# EAGLE design bat_mini2 (EAGLE 9.0.0)
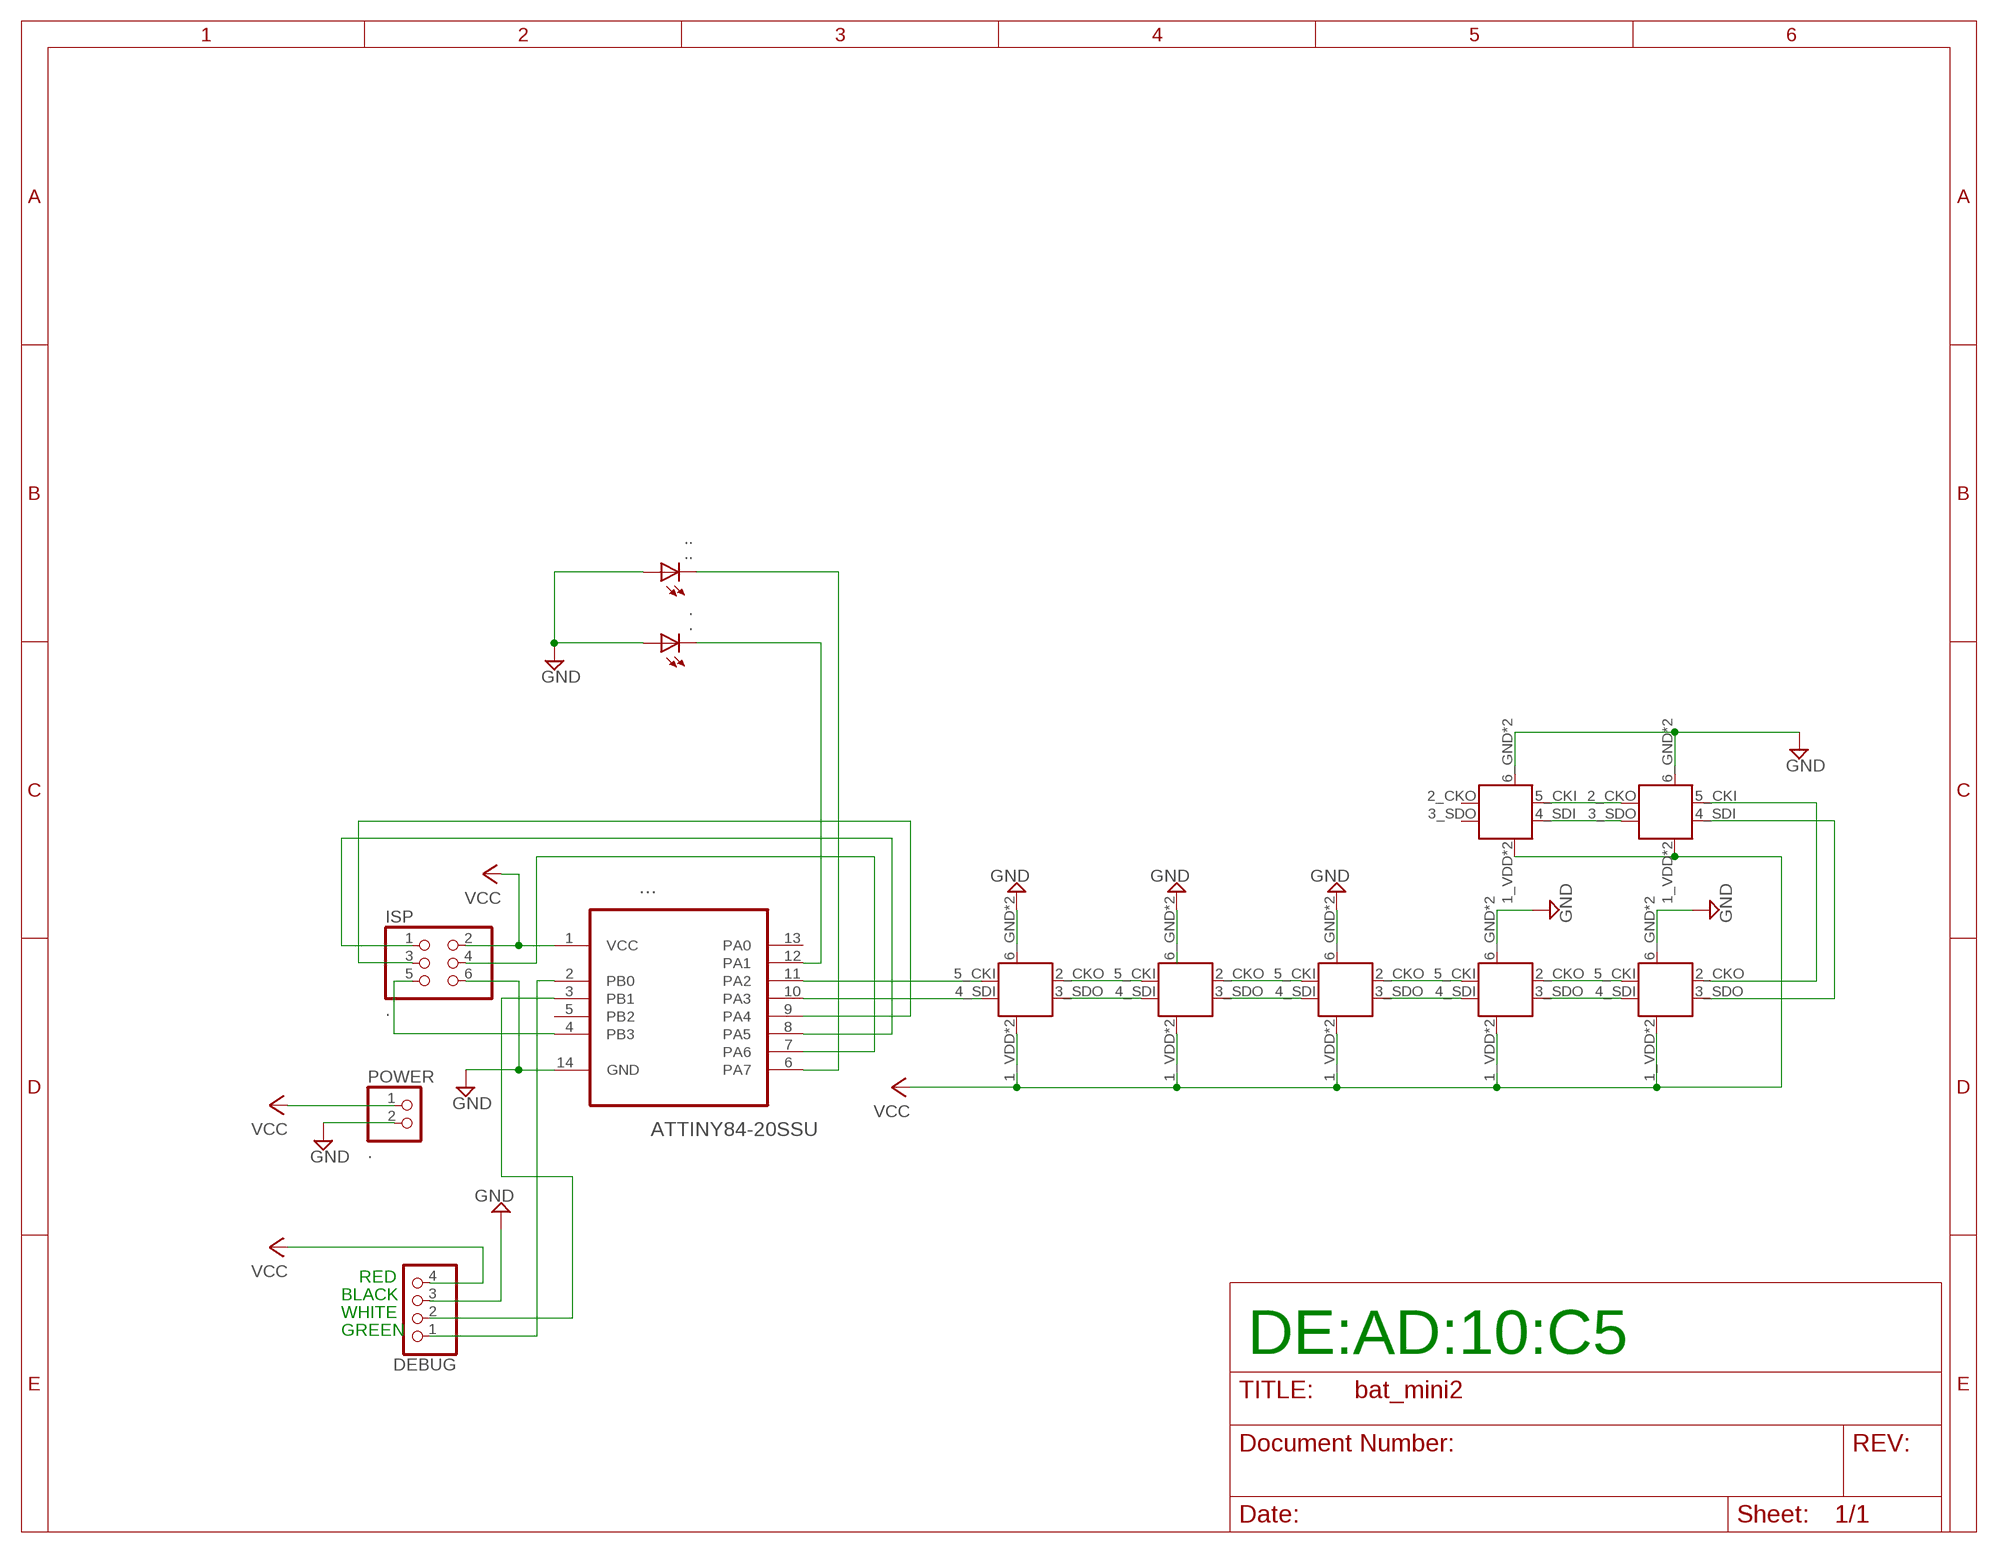
[diagram p0: schematic, sheet 1]

## Parts
.  .  LEDCHIP-LED0805  [CHIP-LED0805]
..  ..  LEDCHIP-LED0805  [CHIP-LED0805]
...  ATTINY84-20SSU  [SOIC127P600X175-14N]
DEBUG  PINHD-1X4  [1X04]
EYE1  APA102  [APA102-2020]
EYE2  APA102  [APA102-2020]
ISP  .  PINHD-2X3  [2X03]
POWER  .  PINHD-1X2  [1X02]
U$4  APA102  [APA102-2020]
U$5  APA102  [APA102-2020]
U$6  APA102  [APA102-2020]
U$7  APA102  [APA102-2020]
U$8  APA102  [APA102-2020]

## Nets
GND: ....14(GND) ...A ..A DEBUG.3 EYE1.6_GND(GND) EYE1.GNDPAD(GND) ISP.6 POWER.2 U$5.6_GND(GND) U$5.GNDPAD(GND) U$6.6_GND(GND) U$6.GNDPAD(GND) U$8.6_GND(GND) U$8.GNDPAD(GND)
N$1: ....2(PB0) DEBUG.1
N$3: ....8(PA5) ISP.1
N$4: ....7(PA6) ISP.4
N$5: ....9(PA4) ISP.3
N$6: ....4(PB3) ISP.5
N$7: ....12(PA1) ..C
N$8: ....6(PA7) ...C
N$9: ....11(PA2) EYE1.5_CKI(CKI)
N$10: ....10(PA3) EYE1.4_SDI(SDI)
N$11: EYE1.3_SDO(SDO) EYE2.4_SDI(SDI)
N$12: EYE1.2_CKO(CKO) EYE2.5_CKI(CKI)
N$13: EYE2.3_SDO(SDO) U$4.4_SDI(SDI)
N$14: EYE2.2_CKO(CKO) U$4.5_CKI(CKI)
N$15: ....3(PB1) DEBUG.2
N$16: U$4.3_SDO(SDO) U$5.4_SDI(SDI)
N$17: U$4.2_CKO(CKO) U$5.5_CKI(CKI)
N$18: U$5.3_SDO(SDO) U$6.4_SDI(SDI)
N$19: U$5.2_CKO(CKO) U$6.5_CKI(CKI)
N$20: U$6.2_CKO(CKO) U$7.5_CKI(CKI)
N$21: U$6.3_SDO(SDO) U$7.4_SDI(SDI)
N$22: U$7.3_SDO(SDO) U$8.4_SDI(SDI)
N$23: U$7.2_CKO(CKO) U$8.5_CKI(CKI)
VCC: ....1(VCC) DEBUG.4 EYE1.1_VDD(VCC) EYE1.VDDPAD(VCC) EYE2.1_VDD(VCC) EYE2.VDDPAD(VCC) ISP.2 POWER.1 U$4.1_VDD(VCC) U$4.VDDPAD(VCC) U$5.1_VDD(VCC) U$5.VDDPAD(VCC) U$6.1_VDD(VCC) U$6.VDDPAD(VCC) U$7.1_VDD(VCC) U$7.VDDPAD(VCC) U$8.1_VDD(VCC) U$8.VDDPAD(VCC)
Unconnected: ....5(PB2) ....13(PA0) U$8.2_CKO(CKO) U$8.3_SDO(SDO)

## Notes on the sheet
- RED
- BLACK
- WHITE
- GREEN
- DE:AD:10:C5

## Power pins joined to a net without a drawn wire
GND: EYE2.6_GND(GND) EYE2.GNDPAD(GND) U$4.6_GND(GND) U$4.GNDPAD(GND) U$7.6_GND(GND) U$7.GNDPAD(GND)

## Library data of the parts
. .. = led:LED: LED OSRAM: - CHIPLED LG R971, LG N971, LY N971, LG Q971, LY Q971, LO R971, LY R971 LH N974, LH R974 LS Q976, LO Q976, LY Q976 LO Q996 - Hyper CHIPLED LW Q18S LB Q993, LB Q99A, LB R99A - SideLED LS A670, LO A670, LY A670, LG A670, LP A670 LB A673, LV A673, LT A673, LW A673 LH A674 LY A675 LS A676, LA A676, LO A676, LY A676, LW A676 LS A679, LY A679, LG A679 - Hyper Micro SIDELED® LS Y876, LA Y876, LO Y876, LY Y876 LT Y87S - SmartLED LW L88C, LW L88S LB L89C, LB L89S, LG L890 LS L89K, LO L89K, LY L89K LS L896, LA L896, LO L896, LY L896 - TOPLED LS T670, LO T670, LY T670, LG T670, LP T670 LSG T670, LSP T670, LSY T670, LOP T670, LYG T670 LG T671, LOG T671, LSG T671 LB T673, LV T673, LT T673, LW T673 LH T674 LS T676, LA T676, LO T676, LY T676, LB T676, LH T676, LSB T676, LW T676 LB T67C, LV T67C, LT T67C, LS T67K, LO T67K, LY T67K, LW E67C LS E67B, LA E67B, LO E67B, LY E67B, LB E67C, LV E67C, LT E67C LW T67C LS T679, LY T679, LG T679 LS T770, LO T770, LY T770, LG T770, LP T770 LB T773, LV T773, LT T773, LW T773 LH T774 LS E675, LA E675, LY E675, LS T675 LS T776, LA T776, LO T776, LY T776, LB T776 LHGB T686 LT T68C, LB T68C - Hyper Mini TOPLED® LB M676 - Mini TOPLED Santana® LG M470 LS M47K, LO M47K, LY M47K Source: http://www.osram.convergy.de LUXEON: - LUMILED® LXK2-PW12-R00, LXK2-PW12-S00, LXK2-PW14-U00, LXK2-PW14-V00 LXK2-PM12-R00, LXK2-PM12-S00, LXK2-PM14-U00 LXK2-PE12-Q00, LXK2-PE12-R00, LXK2-PE12-S00, LXK2-PE14-T00, LXK2-PE14-U00 LXK2-PB12-K00, LXK2-PB12-L00, LXK2-PB12-M00, LXK2-PB14-N00, LXK2-PB14-P00, LXK2-PB14-Q00 LXK2-PR12-L00, LXK2-PR12-M00, LXK2-PR14-Q00, LXK2-PR14-R00 LXK2-PD12-Q00, LXK2-PD12-R00, LXK2-PD12-S00 LXK2-PH12-R00, LXK2-PH12-S00 LXK2-PL12-P00, LXK2-PL12-Q00, LXK2-PL12-R00 Source: www.luxeon.com KINGBRIGHT: KA-3528ASYC Source: www.kingbright.com
... = Atmel_By_element14_Batch_1-00:ATTINY84-20SSU: 8-bit Microcontroller with Bytes In-System Programmable Flash; OC_FARNELL: 1636955; OC_NEWARK: 03P2040; PACKAGE: SOIC-14; SUPPLIER: Atmel
DEBUG = pinhead:PINHD-1X4: PIN HEADER
EYE1 EYE2 U$4-U$8 = pimoroni-optoelectronics:APA102
ISP = pinhead:PINHD-2X3: PIN HEADER
POWER = pinhead:PINHD-1X2: PIN HEADER

## Board
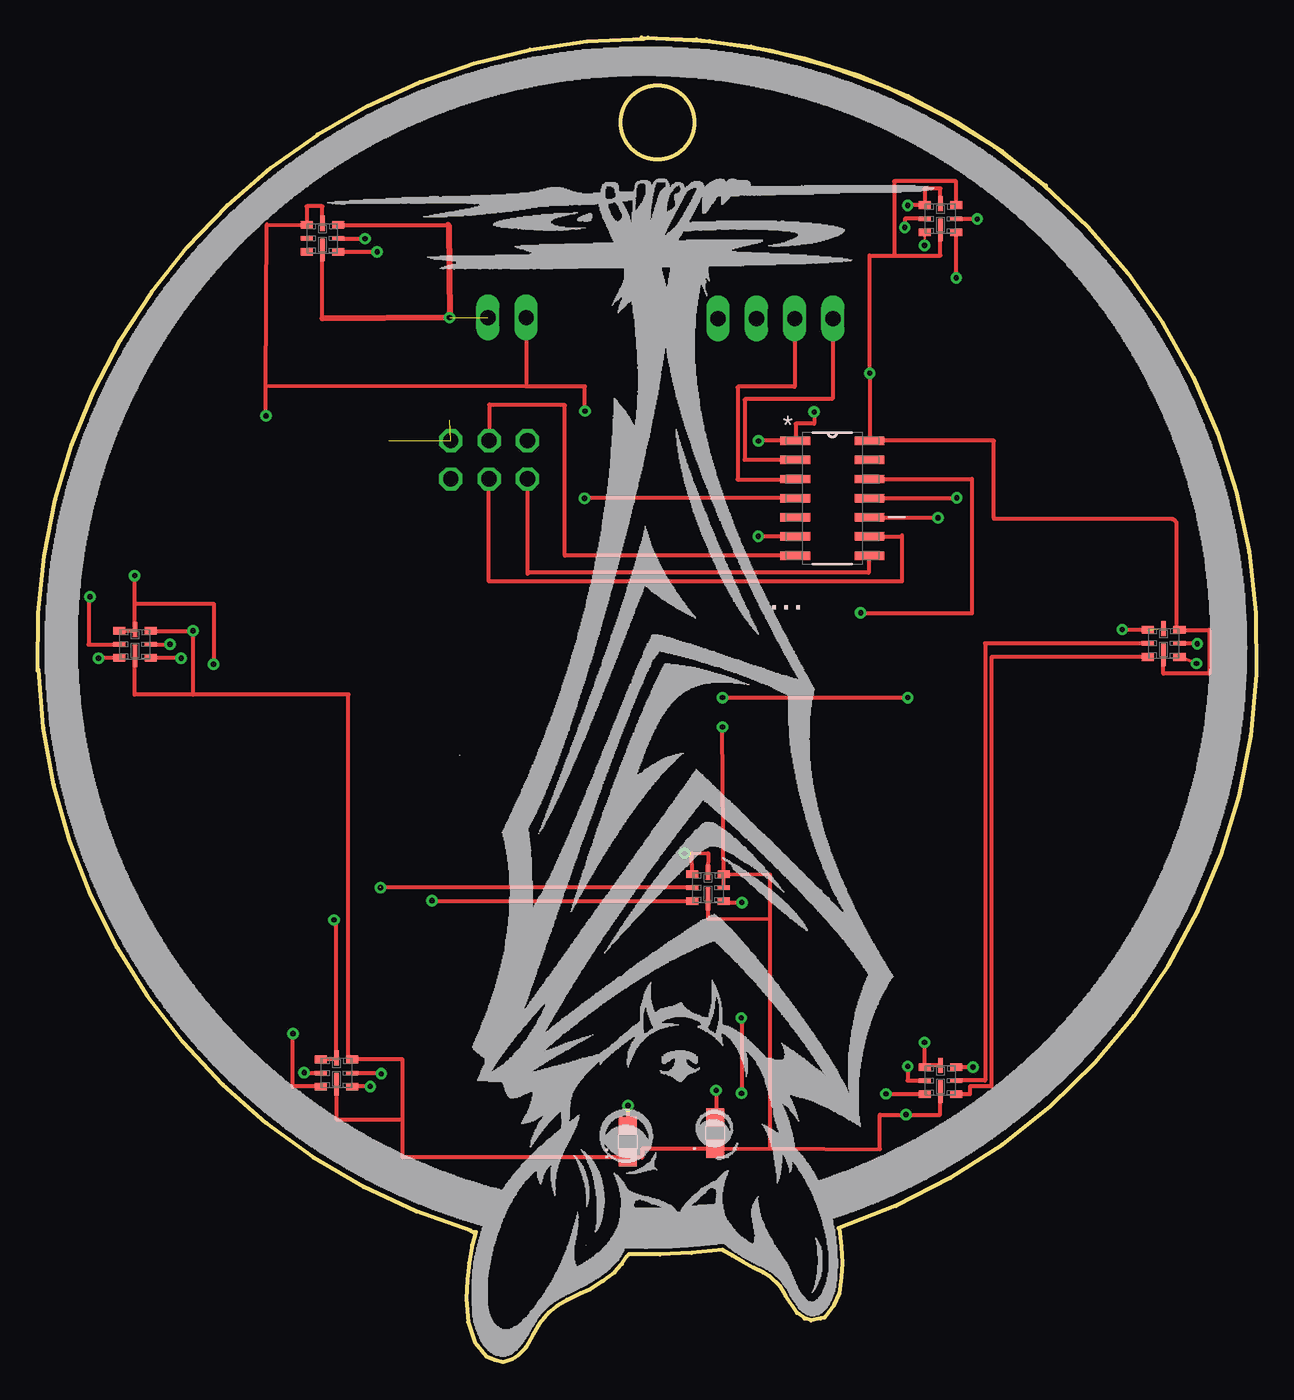
[diagram p1: board, top side]
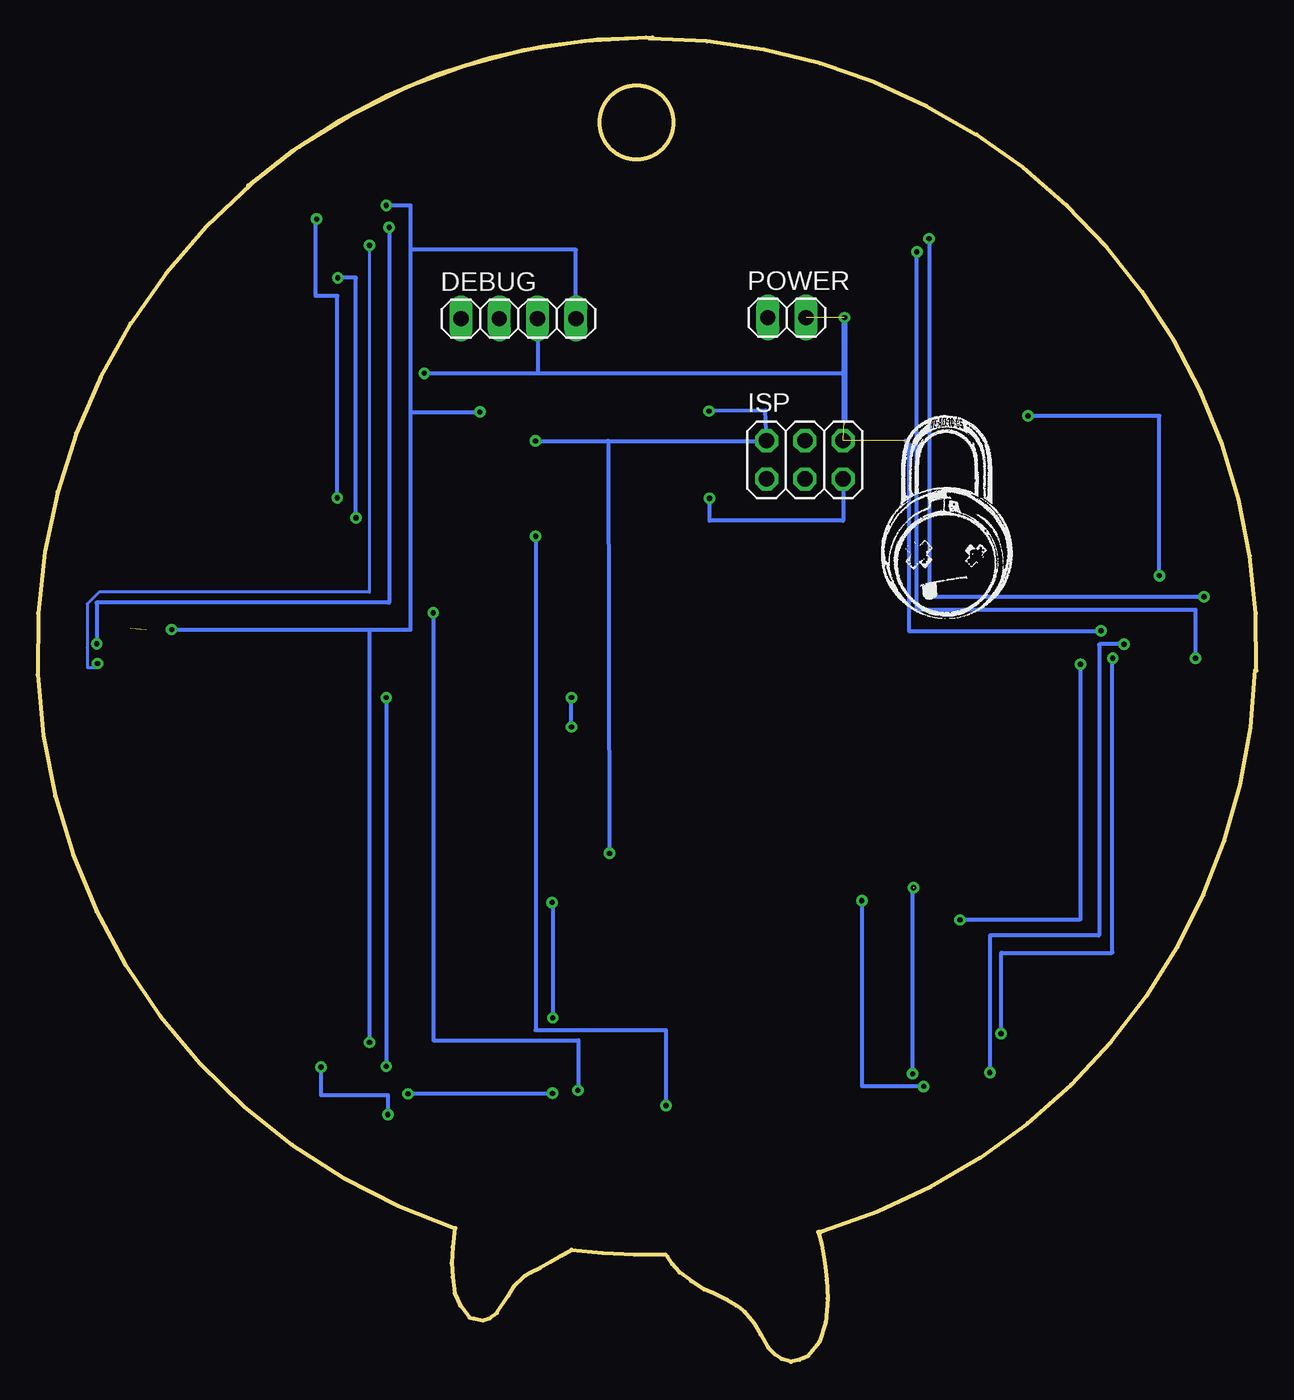
[diagram p2: board, bottom side, seen from below]

Size 80.84 x 87.88 mm. Coordinates in mm from the lower left corner, seen from the top.
Outline: 40.5,87.88 arc-161 53.12,8.88
Outline: 40.06,87.88 arc-41 66.88,78.06
Outline: 0,45.88 arc-92 40.25,87.81
Outline: 28.75,8.69 arc-71 0.06,45.94
Outline: 45.44,7.44 arc-9 39.19,7.13
Outline: 28.88,8.63 29.06,8.63 28.81,7.75 28.62,6.56 28.5,5.44 28.44,4.19 28.56,2.63 29,1.31 29.75,0.38 30.31,0.13 30.88,0 31.5,0.19 31.94,0.5 32.38,0.94 32.88,1.81 33.31,2.56 33.94,3.31 34.5,3.75 35.12,4.13 36,4.56 36.62,4.81 37.5,5.38 38.25,5.94 38.75,6.5 39.06,7
Outline: 53.19,8.88 53.31,7.63 53.38,6.56 53.31,5.63 53.19,4.56 52.81,3.75 52.19,2.94 51.94,2.88 51.31,2.75 50.88,2.88 50.38,3.25 49.62,4.38 49.25,5 48.56,5.69 48.12,5.94 47.5,6.25 46.81,6.63 46.06,7.06 45.5,7.38
Outline: circle at 41.12,82.25 radius 2.44
Copper layers (1*16): Top 0.035mm / dielectric 1.5mm / Bottom 0.035mm
Design rules "default": minimum track width 6mil, minimum drill 0.35mm, track to track 6mil, track to pad 6mil, pad to pad 6mil, via to via 6mil, smd to smd 6mil, copper to edge 40mil, drill to drill 6mil, minimum pad ring 10mil, minimum via ring 8mil, stop-mask expansion 4mil, vias tented up to drill 0mil, thermal gap 10mil

### Footprints (pad centres in the part's own frame; a part is rotated, then mirrored left to right if it is on the bottom)
CHIP-LED0805 = smd 1.2 x 1.2: A 0,-1.05; C 0,1.05
SOIC127P600X175-14N = smd 1.981 x 0.559: 1 -2.464,3.81; 2 -2.464,2.54; 3 -2.464,1.27; 4 -2.464,0; 5 -2.464,-1.27; 6 -2.464,-2.54; 7 -2.464,-3.81; 8 2.464,-3.81; 9 2.464,-2.54; 10 2.464,-1.27; 11 2.464,0; 12 2.464,1.27; 13 2.464,2.54; 14 2.464,3.81
1X04 = drill 1.016 long: 1 -3.81,0; 2 -1.27,0; 3 1.27,0; 4 3.81,0
APA102-2020 = smd 0.8 x 0.5: 1_VDD -1.05,0.9; 3_SDO -1.05,-0.9; 4_SDI 1.05,-0.9; 6_GND 1.05,0.9 | smd 0.8 x 0.3: 2_CKO -1.05,0; 5_CKI 1.05,0 | smd 0.3 x 1.5: GNDPAD 0,-0.75 | smd 0.3 x 1: VDDPAD 0,1
2X03 = drill 1.016 octagon: 1 -2.54,-1.27; 2 -2.54,1.27; 3 0,-1.27; 4 0,1.27; 5 2.54,-1.27; 6 2.54,1.27
1X02 = drill 1.016 long: 1 -1.27,0; 2 1.27,0

### Placement (x,y rotation side)
.  44.95,15.17 0 top
..  39.13,14.61 0 top
...  52.72,57.31 0 top
DEBUG  48.95,69.23 0 bottom
EYE1  59.88,75.86 0 top
EYE2  74.7,47.67 0 top
ISP  29.95,59.86 0 bottom
POWER  31.13,69.3 0 bottom
U$4  59.88,18.67 0 top
U$5  44.47,31.47 0 top
U$6  19.82,19.17 0 top
U$7  6.45,47.61 0 top
U$8  18.89,74.55 0 top

### Tracks (layer width: path | path; a pad name or v marks a point on that pad's centre or on a via)
GND  (via drill 0.35)  (3 unrouted)
  Top 0.254: 18.89,69.23 U$8.GNDPAD | U$8.6_GND 27.23,75.45 | 55.18,65.6 v55.2,65.61 | v55.2,65.61 55.2,73.42 56.81,73.42 | 56.81,73.42 59.88,73.42 EYE1.GNDPAD | EYE1.6_GND 60.94,78.34 56.81,78.34 56.81,73.42 | EYE2.GNDPAD 74.68,46.92 74.68,45.67 77.7,45.67 77.7,48.57 EYE2.6_GND arc-90 75.56,48.76 75.56,55.56 arc90 75.19,55.94 63.5,55.94 arc-90 63.44,56 63.44,61.13 arc-90 63.44,61.12 ....14 55.18,65.6 | 24.21,16.1 24.21,13.56 ...A 40.09,13.54 40.09,14.12 ..A 48.55,14.18 | 24.21,16.1 24.21,20.07 U$6.6_GND U$6.6_GND arc-90 20.61,20.33 20.61,44.3 arc-90 20.59,44.28 10.3,44.28 | U$6.GNDPAD 19.82,16.1 24.21,16.1 | U$7.6_GND v10.3,48.51 10.3,44.28 | 10.3,44.28 6.43,44.28 6.43,46.86 U$7.GNDPAD | U$5.6_GND 48.57,32.34 48.57,29.36 | 48.57,29.36 44.47,29.4 U$5.GNDPAD | 48.55,14.18 55.87,14.1 55.87,16.4 v57.61,16.4 59.87,16.4 U$4.GNDPAD | 48.57,29.36 48.55,14.18 | U$4.6_GND v62.05,19.56 | v55.2,65.61 arc90 55.18,65.6
  Top 0.406: 27.23,75.45 27.26,75.42 v27.32,69.3 18.89,69.23
  Bottom 0.254: 47.68,65.63 47.7,65.61 27.51,65.61 27.32,65.8 | v55.2,65.61 55.18,65.63 47.68,65.63 | v10.3,48.51 v10.31,48.5 23.04,48.5 23.04,60.88 23.29,61.13 | DEBUG.3 47.68,65.63 | v62.05,19.56 62.05,17.7 57.61,17.7 v57.61,16.4
  Bottom 0.406: v27.32,69.3 27.32,65.8 27.32,62.48
N$1
  Top 0.254: DEBUG.1 52.76,63.97 52.69,63.9 46.95,63.9 46.89,63.84 46.89,59.86 50.25,59.86 ....2
N$2
  Top 0.254: 55.17,65.62 55.21,65.66
N$3
  Top 0.254: ....8 55.12,53.5 55.12,52.37 32.5,52.37 | 32.5,52.37 32.5,52.3 | 32.5,52.37 32.5,58.59 ISP.1
N$4
  Top 0.254: ....7 34.97,53.5 34.97,63.48 29.96,63.48 | 29.96,63.48 29.96,63.55 | 29.96,63.48 29.96,61.13 ISP.4
N$5
  Top 0.254: ....9 57.33,54.77 | 57.33,54.77 57.33,54.84 | 57.33,54.77 57.33,51.78 29.93,51.78 29.93,58.59 ISP.3
N$6  (via drill 0.35)
  Top 0.254: ....4 v36.27,57.31
  Bottom 0.254: v36.27,57.31 36.27,55.81 27.41,55.81 ISP.5
N$7  (via drill 0.35)
  Top 0.254: ....12 61.97,58.58 61.97,49.67 54.6,49.67 v54.6,49.7 | v45.01,18.02 45.01,16.22 ..C
  Bottom 0.254: v54.6,49.7 54.6,21.33 44.98,21.33 44.98,18.02 v45.01,18.02
N$8  (via drill 0.35)
  Top 0.254: ....6 v47.8,54.77 | v39.16,17.01 39.16,15.66 ...C
  Bottom 0.254: v47.8,54.77 47.8,22.02 39.16,22.02 v39.16,17.01
N$9  (via drill 0.35)
  Top 0.254: ....11 60.97,57.31 v60.97,57.34 | v62.33,75.83 60.94,75.83 EYE1.5_CKI
  Bottom 0.254: v60.97,57.34 60.97,70.73 62.4,70.73 62.4,75.83 v62.33,75.83
N$10  (via drill 0.35)
  Top 0.254: ....10 59.73,56.04 v59.73,56.01 | v60.94,71.94 EYE1.4_SDI
  Bottom 0.254: v59.73,56.01 59.73,71.94 v60.94,71.94 60.97,71.94
N$11  (via drill 0.35)
  Top 0.152: EYE1.3_SDO v58.84,74.08 v58.83,74.08
  Top 0.203: v76.87,46.34 EYE2.4_SDI
  Bottom 0.203: v58.83,74.08 58.83,51.08 76.77,51.08 77.56,50.29 77.56,47.4 77.55,47.39 77.55,46.06 76.87,46.06 v76.87,46.34
N$12  (via drill 0.35)
  Top 0.254: EYE1.2_CKO 57.52,75.86 v57.52,75.28 | v76.92,47.66 EYE2.5_CKI
  Bottom 0.254: v57.52,75.28 57.52,50.39 76.92,50.39 v76.92,47.66
N$13
  Top 0.254: EYE2.3_SDO 63.26,46.77 63.26,18.27 61.84,18.27 61.84,17.76 60.94,17.76 U$4.4_SDI
N$14
  Top 0.254: EYE2.2_CKO 62.85,47.67 62.85,18.67 U$4.5_CKI
N$15
  Top 0.254: DEBUG.2 50.22,64.73 50.19,64.7 46.45,64.7 46.43,64.68 46.43,58.56 50.24,58.56 ....3
N$16  (via drill 0.35)
  Top 0.254: U$5.4_SDI arc90 45.6,30.48 v46.71,30.48 | v46.67,22.82 arc-90 46.69,22.8 v46.69,17.82 | v56.27,17.78 arc90 v56.28,17.77 U$4.3_SDO
  Bottom 0.254: v46.71,30.48 arc90 46.67,30.44 v46.67,22.82 | v46.69,17.82 arc90 46.73,17.78 v56.27,17.78
N$17  (via drill 0.35)
  Top 0.254: U$5.5_CKI 45.42,42.11 45.43,42.1 v45.43,42.13 | v57.72,19.61 57.72,18.67 U$4.2_CKO | v45.43,44.08 v57.72,44.08
  Bottom 0.254: v45.43,42.13 v45.43,44.08 | v57.72,44.08 v57.72,19.61
N$18  (via drill 0.35)
  Top 0.254: v22.07,18.28 U$6.4_SDI | U$5.3_SDO 26.2,30.57 v26.17,30.6
  Bottom 0.254: v26.17,30.6 26.17,18.32 26.15,18.3 22.09,18.3 v22.07,18.28
N$19  (via drill 0.35)  (1 unrouted)
  Top 0.254: U$6.5_CKI 22.7,19.17 v22.8,19.11 | U$5.2_CKO 22.7,31.47 22.69,31.48
  Bottom 0.254: v22.8,19.11 22.8,31.42 v22.75,31.47
N$20  (via drill 0.35)
  Top 0.254: U$7.5_CKI 8.76,47.61 v8.77,47.63 | v17.68,19.19 17.69,19.17 U$6.2_CKO
  Bottom 0.254: v8.77,47.63 10.4,47.63 10.43,47.59 10.43,28.32 10.46,28.29 17.68,28.29 v17.68,19.19
N$21  (via drill 0.35)
  Top 0.254: U$6.3_SDO 16.96,18.27 16.93,18.25 v16.93,21.79 | v9.52,46.68 9.49,46.71 U$7.4_SDI
  Bottom 0.254: v16.93,21.79 16.93,27.12 16.9,27.15 9.59,27.15 9.55,27.18 9.55,46.65 v9.52,46.68
N$22  (via drill 0.35)
  Top 0.254: U$7.3_SDO 4.03,46.71 v4.03,46.68 | v22.52,73.66 U$8.4_SDI
  Bottom 0.254: v4.03,46.68 4.03,49.9 22.52,49.9 v22.52,73.66
N$23  (via drill 0.35)
  Top 0.254: U$8.5_CKI 19.93,74.53 v21.71,74.53 | v3.47,50.78 3.38,50.78 3.38,47.61 | 3.38,47.59 3.38,47.61 | 3.38,47.61 U$7.2_CKO
  Bottom 0.254: v21.71,74.53 21.71,50.78 v3.47,50.78
VCC  (via drill 0.35)  (1 unrouted)
  Top 0.254: v47.82,61.11 47.84,61.12 ....1 50.27,61.12 50.27,62.25 51.51,62.25 v51.51,63.03 | EYE1.VDDPAD 59.88,77.86 58.82,77.86 58.84,77.85 EYE1.1_VDD 57.72,76.76 v57.72,76.75 | v36.3,63.09 36.3,64.72 32.4,64.73 | 32.4,64.73 15.14,64.75 | 15.14,64.75 15.21,75.48 U$8.1_VDD 17.84,76.68 18.88,76.68 U$8.VDDPAD | POWER.1 32.4,64.73 | v71.95,48.6 73.65,48.6 EYE2.1_VDD | U$4.VDDPAD 58.84,19.67 U$4.1_VDD 58.84,21.19 v58.82,21.2 | U$7.1_VDD 6.45,48.51 U$7.VDDPAD 6.45,50.32 | U$6.1_VDD 19.82,20.07 U$6.VDDPAD 19.82,29.16 v19.66,29.33 | 6.45,50.32 6.45,52.17 v6.43,52.17 | v15.14,62.77 15.14,64.75 | 6.45,50.32 11.66,50.32 v11.66,46.29 | v42.91,33.74 43.39,33.75 | 43.39,33.75 44.47,33.76 U$5.VDDPAD | U$5.1_VDD 43.39,33.75
  Bottom 0.254: v47.82,61.11 42.99,61.11 | 42.99,61.11 32.51,61.11 ISP.2 32.56,63.13 v36.3,63.09 | 42.99,61.11 v42.91,33.74 | v57.72,76.75 56.12,76.75 56.12,73.74 | 56.12,73.74 56.12,63.03 | 56.12,63.03 v51.51,63.03 | 56.12,63.03 56.12,48.57 58.82,48.57 | v71.95,48.6 71.95,48.57 58.82,48.57 | v6.43,52.17 6.43,62.77 v15.14,62.77 | v11.66,46.29 11.66,29.39 11.73,29.33 v19.66,29.33 | v58.82,21.2 58.82,48.57 | DEBUG.4 45.14,73.79 45.15,73.8 56.06,73.8 56.12,73.74